# EAGLE board logicanalyzer_rev1 (EAGLE 4.16), part 1 of 2
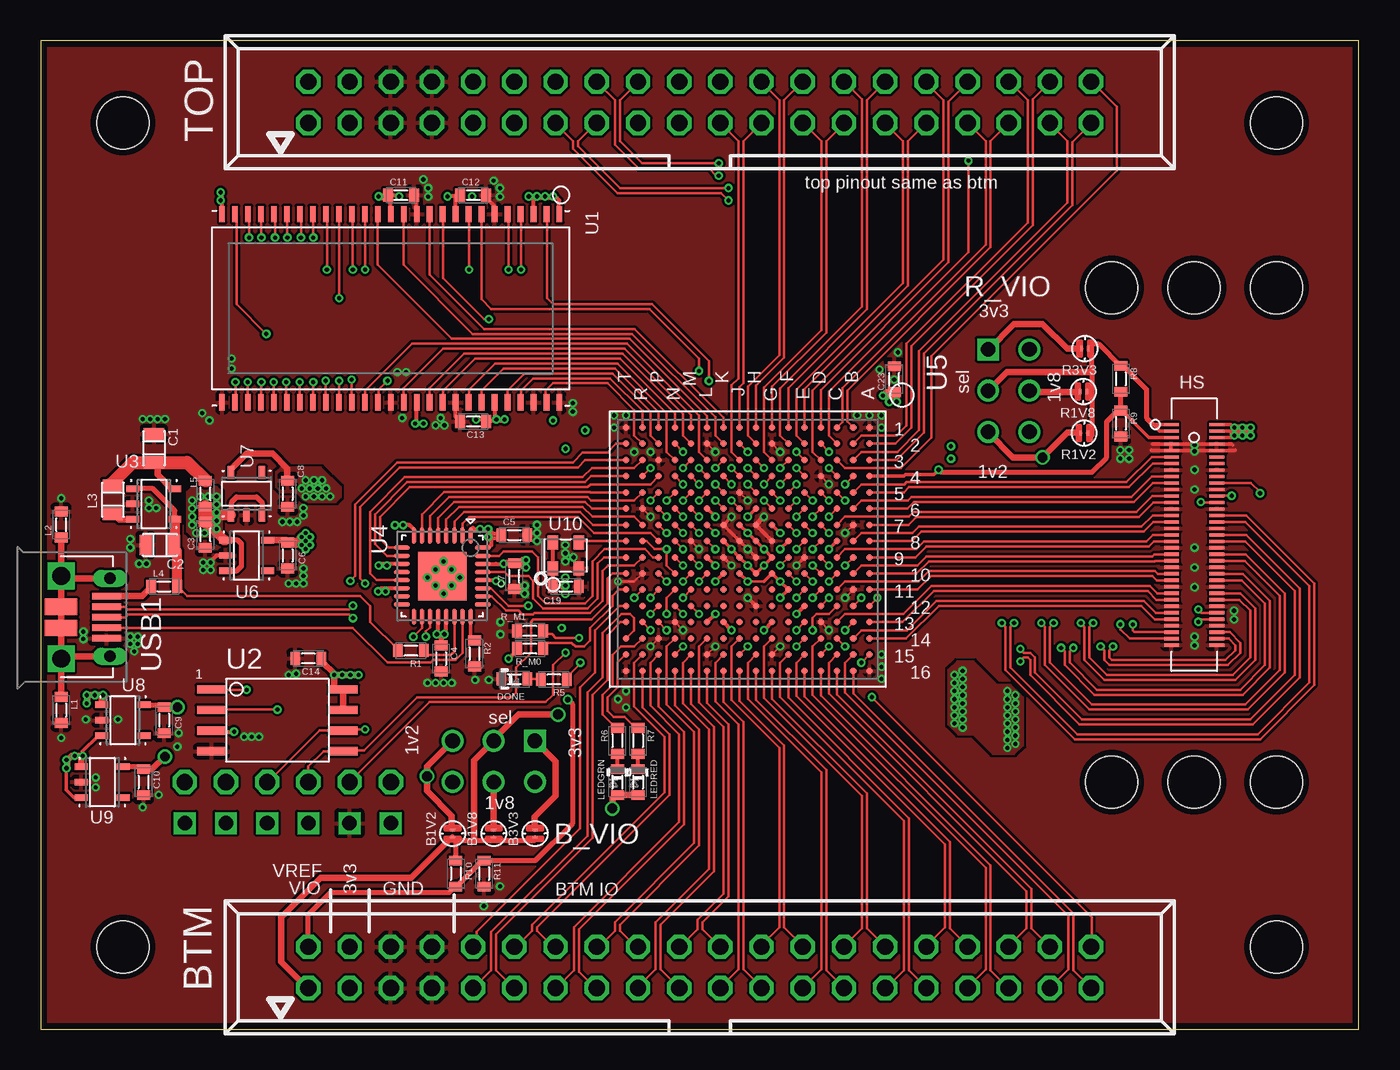
[diagram p4: board, top side]
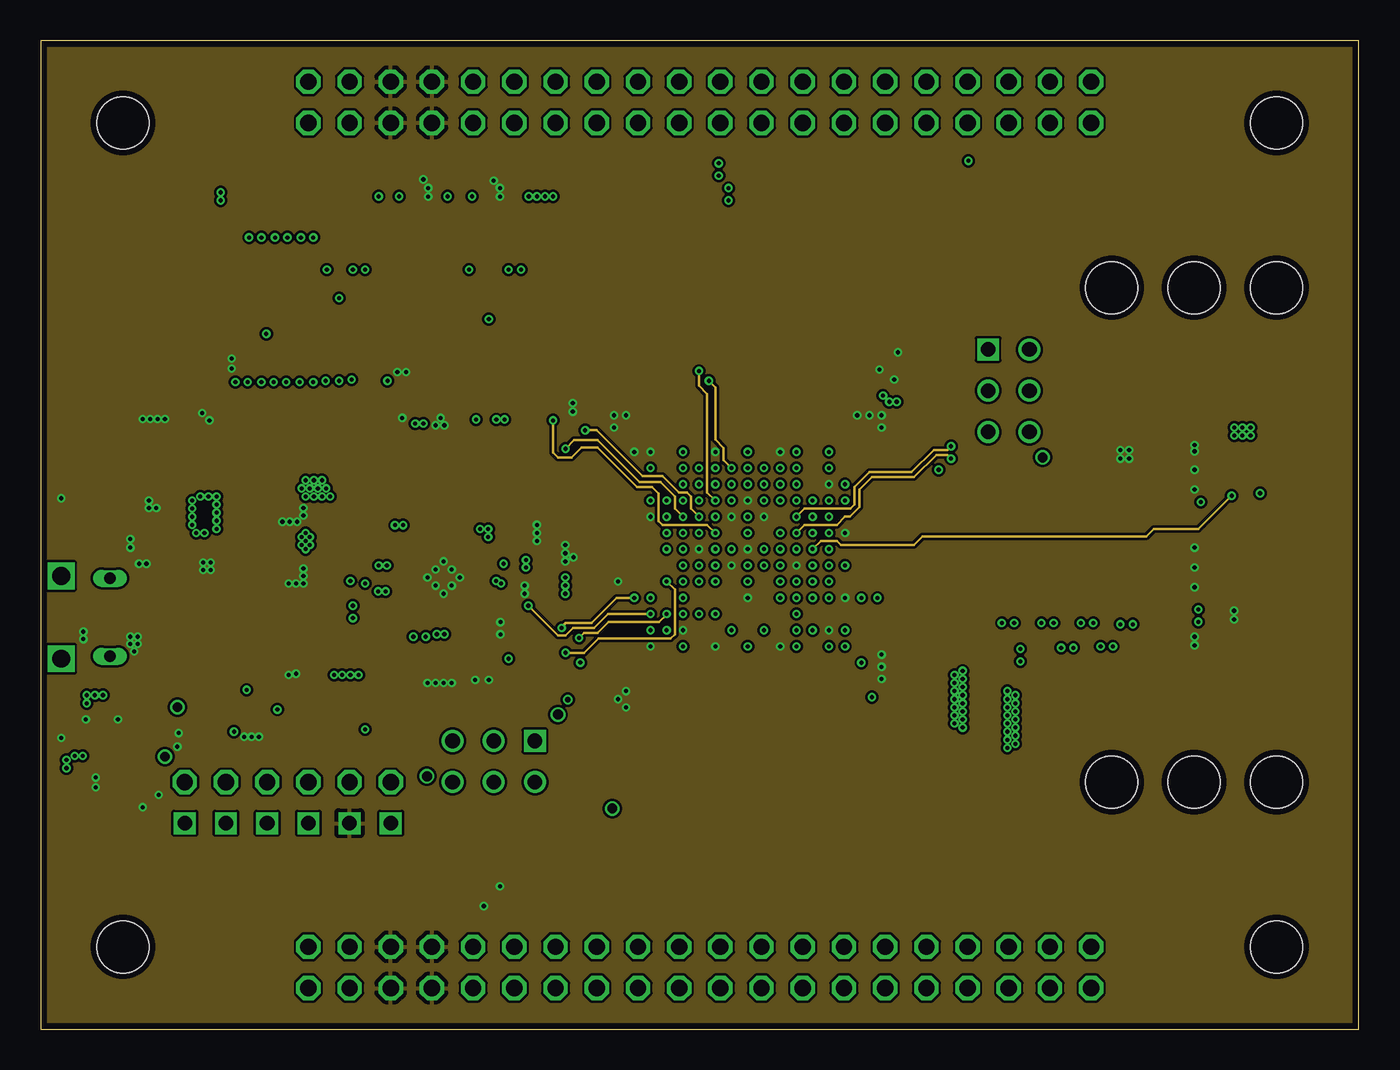
[diagram p5: board, inner layer Route2]
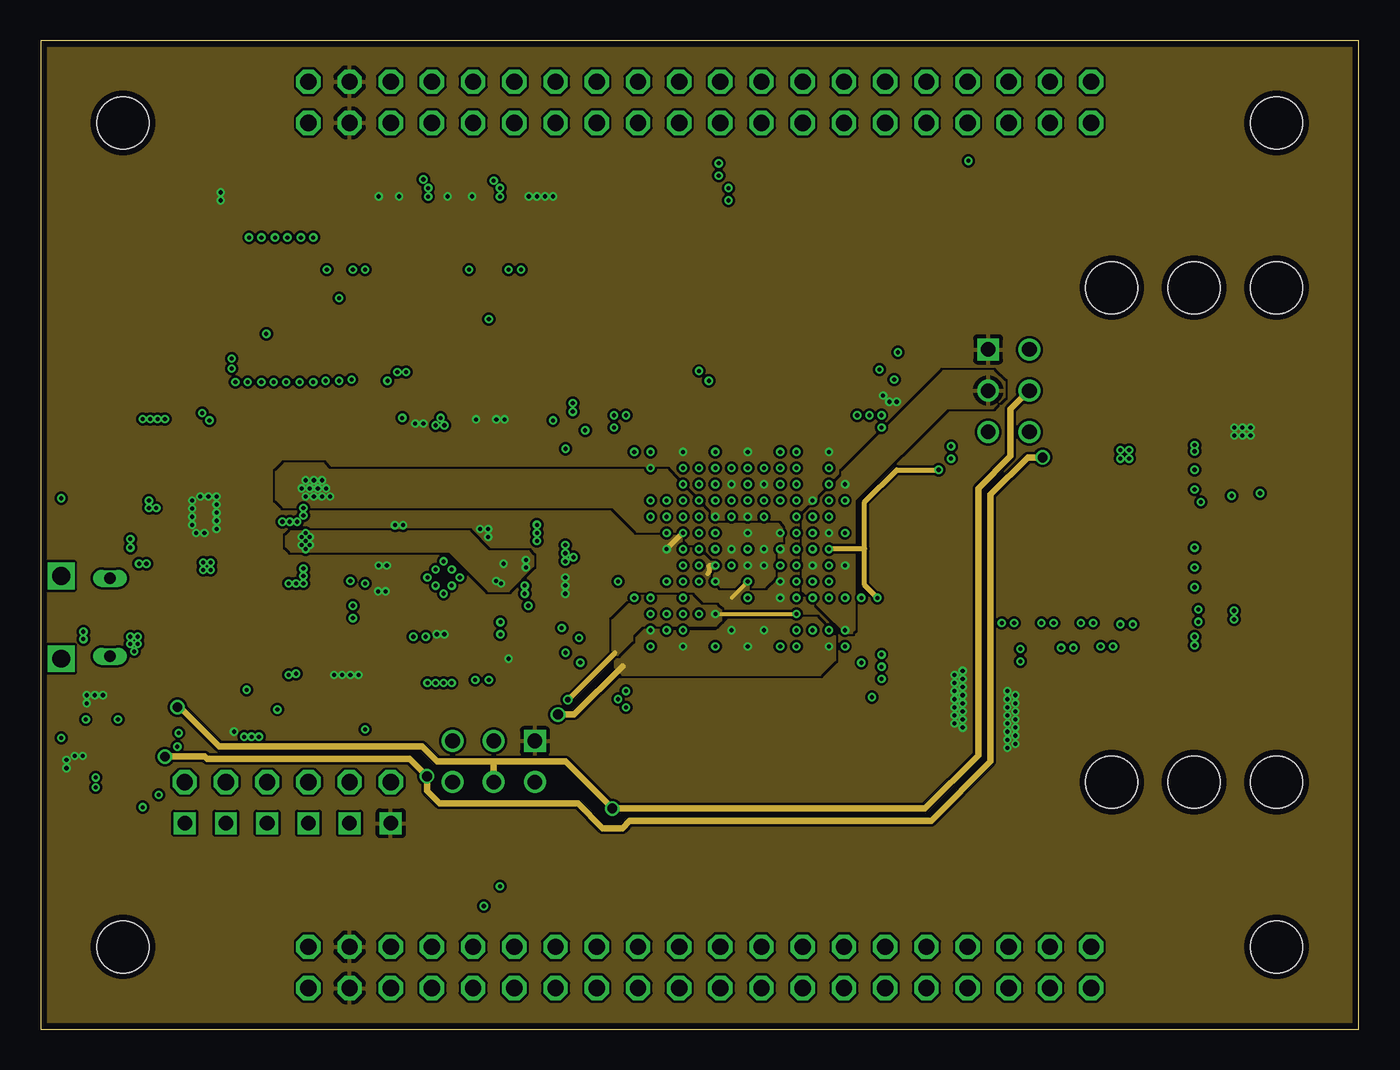
[diagram p6: board, inner layer Route15]
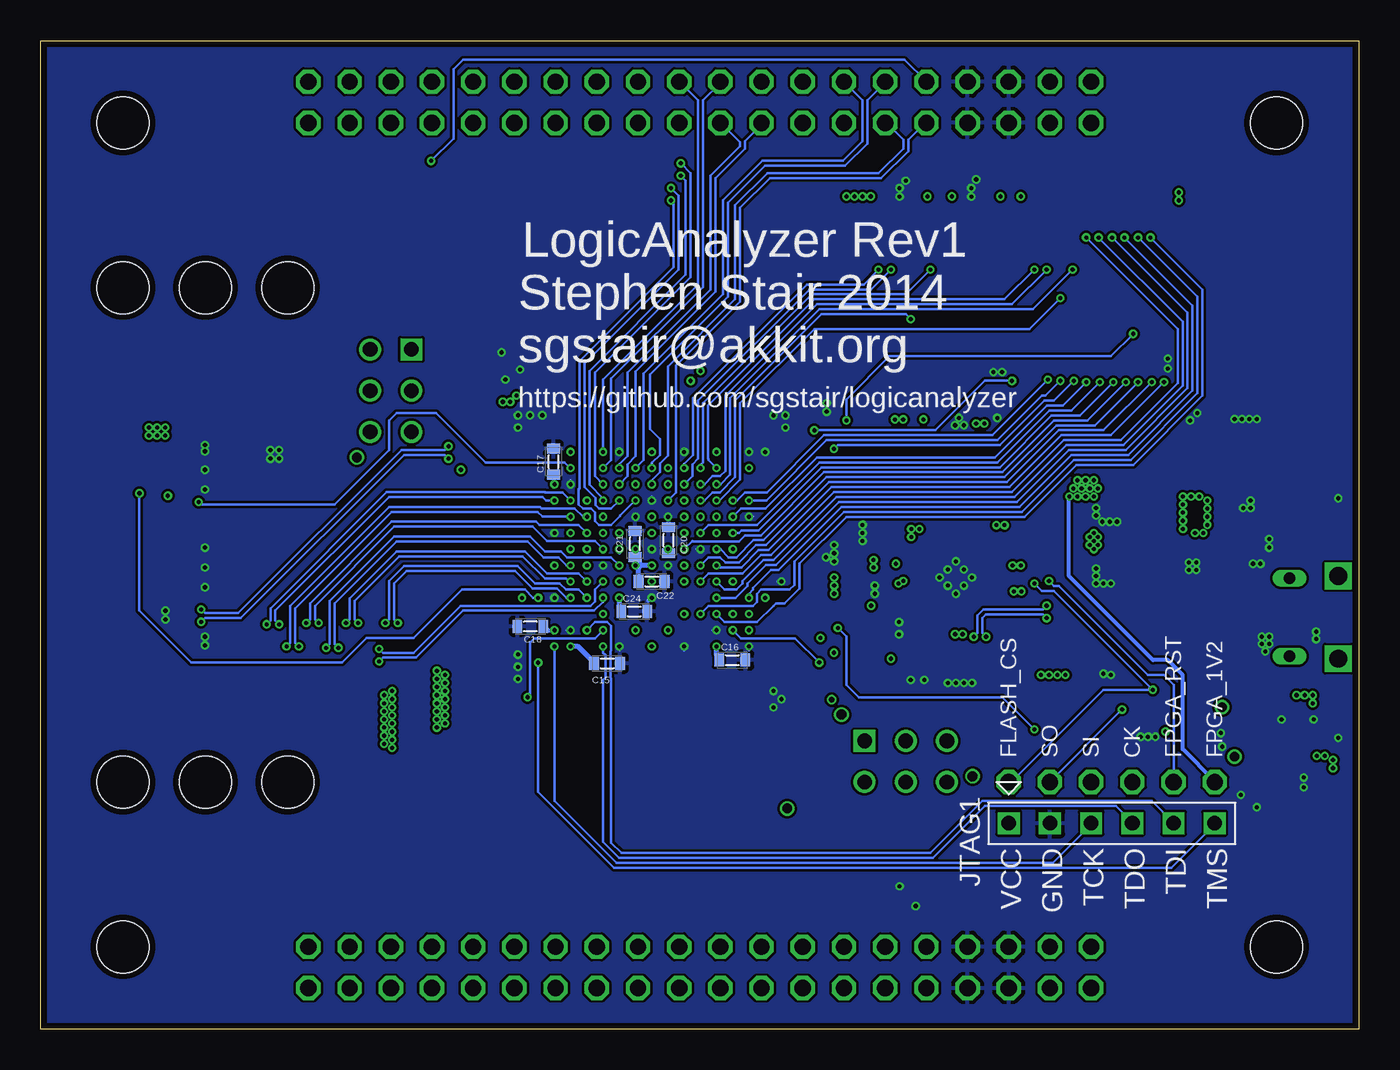
[diagram p7: board, bottom side, seen from below]

Size 81.28 x 60.96 mm. Coordinates in mm from the lower left corner, seen from the top.
Outline: 0,0 81.28,0 81.28,60.96 0,60.96 0,0
Copper layers (1+2*15+16): Top 0.0356mm / dielectric 0.2mm / Route2 0.0181mm / dielectric 1.5mm / Route15 0.0181mm / dielectric 0.2007mm / Bottom 0.0356mm
Design rules "LaenPCBOrder": minimum track width 6mil, minimum drill 10mil, track to track 5mil, track to pad 5mil, pad to pad 5mil, via to via 5mil, smd to smd 5mil, copper to edge 15mil, drill to drill 2mil, minimum pad ring 5mil, minimum via ring 5mil, stop-mask expansion 4mil, vias tented up to drill 25mil, thermal gap 10mil
Holes 3.2 mm at 5.08,5.08 5.08,55.88 76.2,55.88 76.2,5.08 66.04,45.72 71.12,15.24 71.12,45.72 76.2,45.72 66.04,15.24 76.2,15.24
tRestrict: area 23,27.7 to 23.2,28.2; area 24.4,29.5 to 25,29.6; area 26.3,27.6 to 26.4,28.2; area 24.4,26.2 to 25.1,26.3

## Footprints (pad centres in the part's own frame; a part is rotated, then mirrored left to right if it is on the bottom)
JUMPERPAD2 = smd 0.152 x 0.305: P$1 -0.203,0; P$2 0.203,0
HEADER_3X2 = drill 0.9 square: P$1 -1.27,2.54 | drill 0.9 round: P$2 1.27,2.54; P$3 -1.27,0; P$4 1.27,0; P$5 -1.27,-2.54; P$6 1.27,-2.54
057-040-1 = drill 1 octagon: 1 -24.13,-1.27; 2 -24.13,1.27; 3 -21.59,-1.27; 4 -21.59,1.27; 5 -19.05,-1.27; 6 -19.05,1.27; 7 -16.51,-1.27; 8 -16.51,1.27; 9 -13.97,-1.27; 10 -13.97,1.27; 11 -11.43,-1.27; 12 -11.43,1.27; 13 -8.89,-1.27; 14 -8.89,1.27; 15 -6.35,-1.27; 16 -6.35,1.27; 17 -3.81,-1.27; 18 -3.81,1.27; 19 -1.27,-1.27; 20 -1.27,1.27; 21 1.27,-1.27; 22 1.27,1.27; 23 3.81,-1.27; 24 3.81,1.27; 25 6.35,-1.27; 26 6.35,1.27; 27 8.89,-1.27; 28 8.89,1.27; 29 11.43,-1.27; 30 11.43,1.27; 31 13.97,-1.27; 32 13.97,1.27; 33 16.51,-1.27; 34 16.51,1.27; 35 19.05,-1.27; 36 19.05,1.27; 37 21.59,-1.27; 38 21.59,1.27; 39 24.13,-1.27; 40 24.13,1.27
SMD0805 = smd 0.75 x 1.25: P$1 0.125,-0.625; P$2 1.875,-0.625
0603 = smd 0.6 x 0.8: 1 -0.8,0; 2 0.8,0
PIN_1.0MM = drill 1 octagon: P$1 0,0
0603_DIODE = smd 0.6 x 0.8: + 0.8,0; - -0.8,0
DF40_70_BTM = smd 0.2 x 0.9: P$1 -6.8,-1.4; P$2 -6.8,1.4; P$3 -6.4,-1.4; P$4 -6.4,1.4; P$5 -6,-1.4; P$6 -6,1.4; P$7 -5.6,-1.4; P$8 -5.6,1.4; P$9 -5.2,-1.4; P$10 -5.2,1.4; P$11 -4.8,-1.4; P$12 -4.8,1.4; P$13 -4.4,-1.4; P$14 -4.4,1.4; P$15 -4,-1.4; P$16 -4,1.4; P$17 -3.6,-1.4; P$18 -3.6,1.4; P$19 -3.2,-1.4; P$20 -3.2,1.4; P$21 -2.8,-1.4; P$22 -2.8,1.4; P$23 -2.4,-1.4; P$24 -2.4,1.4; P$25 -2,-1.4; P$26 -2,1.4; P$27 -1.6,-1.4; P$28 -1.6,1.4; P$29 -1.2,-1.4; P$30 -1.2,1.4; P$31 -0.8,-1.4; P$32 -0.8,1.4; P$33 -0.4,-1.4; P$34 -0.4,1.4; P$35 0,-1.4; P$36 0,1.4; P$37 0.4,-1.4; P$38 0.4,1.4; P$39 0.8,-1.4; P$40 0.8,1.4; P$41 1.2,-1.4; P$42 1.2,1.4; P$43 1.6,-1.4; P$44 1.6,1.4; P$45 2,-1.4; P$46 2,1.4; P$47 2.4,-1.4; P$48 2.4,1.4; P$49 2.8,-1.4; P$50 2.8,1.4; P$51 3.2,-1.4; P$52 3.2,1.4; P$53 3.6,-1.4; P$54 3.6,1.4; P$55 4,-1.4; P$56 4,1.4; P$57 4.4,-1.4; P$58 4.4,1.4; P$59 4.8,-1.4; P$60 4.8,1.4; P$61 5.2,-1.4; P$62 5.2,1.4; P$63 5.6,-1.4; P$64 5.6,1.4; P$65 6,-1.4; P$66 6,1.4; P$67 6.4,-1.4; P$68 6.4,1.4; P$69 6.8,-1.4; P$70 6.8,1.4
JTAGHEADER6X1 = drill 0.9 square: P$1 0,0; P$2 2.54,0; P$3 5.08,0; P$4 7.62,0; P$5 10.16,0; P$6 12.7,0
TSOP54_0.8MM_12X22 = smd 1 x 0.35: P$1 -5.8,10.4; P$2 -5.8,9.6; P$3 -5.8,8.8; P$4 -5.8,8; P$5 -5.8,7.2; P$6 -5.8,6.4; P$7 -5.8,5.6; P$8 -5.8,4.8; P$9 -5.8,4; P$10 -5.8,3.2; P$11 -5.8,2.4; P$12 -5.8,1.6; P$13 -5.8,0.8; P$14 -5.8,0; P$15 -5.8,-0.8; P$16 -5.8,-1.6; P$17 -5.8,-2.4; P$18 -5.8,-3.2; P$19 -5.8,-4; P$20 -5.8,-4.8; P$21 -5.8,-5.6; P$22 -5.8,-6.4; P$23 -5.8,-7.2; P$24 -5.8,-8; P$25 -5.8,-8.8; P$26 -5.8,-9.6; P$27 -5.8,-10.4; P$28 5.8,-10.4; P$29 5.8,-9.6; P$30 5.8,-8.8; P$31 5.8,-8; P$32 5.8,-7.2; P$33 5.8,-6.4; P$34 5.8,-5.6; P$35 5.8,-4.8; P$36 5.8,-4; P$37 5.8,-3.2; P$38 5.8,-2.4; P$39 5.8,-1.6; P$40 5.8,-0.8; P$41 5.8,0; P$42 5.8,0.8; P$43 5.8,1.6; P$44 5.8,2.4; P$45 5.8,3.2; P$46 5.8,4; P$47 5.8,4.8; P$48 5.8,5.6; P$49 5.8,6.4; P$50 5.8,7.2; P$51 5.8,8; P$52 5.8,8.8; P$53 5.8,9.6; P$54 5.8,10.4
SOIC-8-5.3MM = smd 1.778 x 0.508: P$1 -0.889,-0.635; P$2 -0.889,-1.905; P$3 -0.889,-3.175; P$4 -0.889,-4.445; P$5 7.239,-4.445; P$6 7.239,-3.175; P$7 7.239,-1.905; P$8 7.239,-0.635
SOT-23-5 = smd 0.8 x 0.4: 1 -1.3,0.95; 2 -1.3,0; 3 -1.3,-0.95; 4 1.3,-0.95; 5 1.3,0.95
QFG32PAD_.5MM_5X5 = smd 1 x 0.25: 1 -2.5,1.75; 2 -2.5,1.25; 3 -2.5,0.75; 4 -2.5,0.25; 5 -2.5,-0.25; 6 -2.5,-0.75; 7 -2.5,-1.25; 8 -2.5,-1.75; 17 2.5,-1.75; 18 2.5,-1.25; 19 2.5,-0.75; 20 2.5,-0.25; 21 2.5,0.25; 22 2.5,0.75; 23 2.5,1.25; 24 2.5,1.75 | smd 0.25 x 1: 9 -1.75,-2.5; 10 -1.25,-2.5; 11 -0.75,-2.5; 12 -0.25,-2.5; 13 0.25,-2.5; 14 0.75,-2.5; 15 1.25,-2.5; 16 1.75,-2.5; 25 1.75,2.5; 26 1.25,2.5; 27 0.75,2.5; 28 0.25,2.5; 29 -0.25,2.5; 30 -0.75,2.5; 31 -1.25,2.5; 32 -1.75,2.5 | smd 3 x 3: PAD 0,0
FG256_1MM_17X17 = smd 0.4 x 0.4: A1 -7.5,7.5; A2 -6.5,7.5; A3 -5.5,7.5; A4 -4.5,7.5; A5 -3.5,7.5; A6 -2.5,7.5; A7 -1.5,7.5; A8 -0.5,7.5; A9 0.5,7.5; A10 1.5,7.5; A11 2.5,7.5; A12 3.5,7.5; A13 4.5,7.5; A14 5.5,7.5; A15 6.5,7.5; A16 7.5,7.5; B1 -7.5,6.5; B2 -6.5,6.5; B3 -5.5,6.5; B4 -4.5,6.5; B5 -3.5,6.5; B6 -2.5,6.5; B7 -1.5,6.5; B8 -0.5,6.5; B9 0.5,6.5; B10 1.5,6.5; B11 2.5,6.5; B12 3.5,6.5; B13 4.5,6.5; B14 5.5,6.5; B15 6.5,6.5; B16 7.5,6.5; C1 -7.5,5.5; C2 -6.5,5.5; C3 -5.5,5.5; C4 -4.5,5.5; C5 -3.5,5.5; C6 -2.5,5.5; C7 -1.5,5.5; C8 -0.5,5.5; C9 0.5,5.5; C10 1.5,5.5; C11 2.5,5.5; C12 3.5,5.5; C13 4.5,5.5; C14 5.5,5.5; C15 6.5,5.5; C16 7.5,5.5; D1 -7.5,4.5; D2 -6.5,4.5; D3 -5.5,4.5; D4 -4.5,4.5; D5 -3.5,4.5; D6 -2.5,4.5; D7 -1.5,4.5; D8 -0.5,4.5; D9 0.5,4.5; D10 1.5,4.5; D11 2.5,4.5; D12 3.5,4.5; D13 4.5,4.5; D14 5.5,4.5; D15 6.5,4.5; D16 7.5,4.5; E1 -7.5,3.5; E2 -6.5,3.5; E3 -5.5,3.5; E4 -4.5,3.5; E5 -3.5,3.5; E6 -2.5,3.5; E7 -1.5,3.5; E8 -0.5,3.5; E9 0.5,3.5; E10 1.5,3.5; E11 2.5,3.5; E12 3.5,3.5; E13 4.5,3.5; E14 5.5,3.5; E15 6.5,3.5; E16 7.5,3.5; F1 -7.5,2.5; F2 -6.5,2.5; F3 -5.5,2.5; F4 -4.5,2.5; F5 -3.5,2.5; F6 -2.5,2.5; F7 -1.5,2.5; F8 -0.5,2.5; F9 0.5,2.5; F10 1.5,2.5; F11 2.5,2.5; F12 3.5,2.5; F13 4.5,2.5; F14 5.5,2.5; F15 6.5,2.5; F16 7.5,2.5; G1 -7.5,1.5; G2 -6.5,1.5; G3 -5.5,1.5; G4 -4.5,1.5; G5 -3.5,1.5; G6 -2.5,1.5; G7 -1.5,1.5; G8 -0.5,1.5; G9 0.5,1.5; G10 1.5,1.5; G11 2.5,1.5; G12 3.5,1.5; G13 4.5,1.5; G14 5.5,1.5; G15 6.5,1.5; G16 7.5,1.5; H1 -7.5,0.5; H2 -6.5,0.5; H3 -5.5,0.5; H4 -4.5,0.5; H5 -3.5,0.5; H6 -2.5,0.5; H7 -1.5,0.5; H8 -0.5,0.5; H9 0.5,0.5; H10 1.5,0.5; H11 2.5,0.5; H12 3.5,0.5; H13 4.5,0.5; H14 5.5,0.5; H15 6.5,0.5; H16 7.5,0.5; J1 -7.5,-0.5; J2 -6.5,-0.5; J3 -5.5,-0.5; J4 -4.5,-0.5; J5 -3.5,-0.5; J6 -2.5,-0.5; J7 -1.5,-0.5; J8 -0.5,-0.5; J9 0.5,-0.5; J10 1.5,-0.5; J11 2.5,-0.5; J12 3.5,-0.5; J13 4.5,-0.5; J14 5.5,-0.5; J15 6.5,-0.5; J16 7.5,-0.5; K1 -7.5,-1.5; K2 -6.5,-1.5; K3 -5.5,-1.5; K4 -4.5,-1.5; K5 -3.5,-1.5; K6 -2.5,-1.5; K7 -1.5,-1.5; K8 -0.5,-1.5; K9 0.5,-1.5; K10 1.5,-1.5; K11 2.5,-1.5; K12 3.5,-1.5; K13 4.5,-1.5; K14 5.5,-1.5; K15 6.5,-1.5; K16 7.5,-1.5; L1 -7.5,-2.5; L2 -6.5,-2.5; L3 -5.5,-2.5; L4 -4.5,-2.5; L5 -3.5,-2.5; L6 -2.5,-2.5; L7 -1.5,-2.5; L8 -0.5,-2.5; L9 0.5,-2.5; L10 1.5,-2.5; L11 2.5,-2.5; L12 3.5,-2.5; L13 4.5,-2.5; L14 5.5,-2.5; L15 6.5,-2.5; L16 7.5,-2.5; M1 -7.5,-3.5; M2 -6.5,-3.5; M3 -5.5,-3.5; M4 -4.5,-3.5; M5 -3.5,-3.5; M6 -2.5,-3.5; M7 -1.5,-3.5; M8 -0.5,-3.5; M9 0.5,-3.5; M10 1.5,-3.5; M11 2.5,-3.5; M12 3.5,-3.5; M13 4.5,-3.5; M14 5.5,-3.5; M15 6.5,-3.5; M16 7.5,-3.5; N1 -7.5,-4.5; N2 -6.5,-4.5; N3 -5.5,-4.5; N4 -4.5,-4.5; N5 -3.5,-4.5; N6 -2.5,-4.5; N7 -1.5,-4.5; N8 -0.5,-4.5; N9 0.5,-4.5; N10 1.5,-4.5; N11 2.5,-4.5; N12 3.5,-4.5; N13 4.5,-4.5; N14 5.5,-4.5; N15 6.5,-4.5; N16 7.5,-4.5; P1 -7.5,-5.5; P2 -6.5,-5.5; P3 -5.5,-5.5; P4 -4.5,-5.5; P5 -3.5,-5.5; P6 -2.5,-5.5; P7 -1.5,-5.5; P8 -0.5,-5.5; P9 0.5,-5.5; P10 1.5,-5.5; P11 2.5,-5.5; P12 3.5,-5.5; P13 4.5,-5.5; P14 5.5,-5.5; P15 6.5,-5.5; P16 7.5,-5.5; R1 -7.5,-6.5; R2 -6.5,-6.5; R3 -5.5,-6.5; R4 -4.5,-6.5; R5 -3.5,-6.5; R6 -2.5,-6.5; R7 -1.5,-6.5; R8 -0.5,-6.5; R9 0.5,-6.5; R10 1.5,-6.5; R11 2.5,-6.5; R12 3.5,-6.5; R13 4.5,-6.5; R14 5.5,-6.5; R15 6.5,-6.5; R16 7.5,-6.5; T1 -7.5,-7.5; T2 -6.5,-7.5; T3 -5.5,-7.5; T4 -4.5,-7.5; T5 -3.5,-7.5; T6 -2.5,-7.5; T7 -1.5,-7.5; T8 -0.5,-7.5; T9 0.5,-7.5; T10 1.5,-7.5; T11 2.5,-7.5; T12 3.5,-7.5; T13 4.5,-7.5; T14 5.5,-7.5; T15 6.5,-7.5; T16 7.5,-7.5
ASDMB_2X2.5 = smd 0.65 x 0.85: 1 -0.8,-0.8; 2 0.8,-0.8; 3 0.8,0.8; 4 -0.8,0.8
USB_MICROB_FEMALE_FCI_10103594 = smd 0.4 x 1.8: 1 -1.3,2.8; 2 -0.65,2.8; 3 0,2.8; 4 0.65,2.8; 5 1.3,2.8 | drill 0.7 long: G1 -2.4,3; G2 2.4,3 | smd 1 x 2: G3 -0.65,0; G4 0.65,0 | drill 1.1 square: G5 -2.55,0; G6 2.55,0

## Placement (x,y rotation side)
B1V2  JUMPER2  [JUMPERPAD2]  25.4,12.07 90 top
B1V8  JUMPER2  [JUMPERPAD2]  27.94,12.07 90 top
B3V3  JUMPER2  [JUMPERPAD2]  30.48,12.07 90 top
B_VIO  HEADER_3X2  [HEADER_3X2]  27.94,16.51 270 top
BTM  057-040-1  [057-040-1]  40.64,3.81 0 top
C1  10uF  [SMD0805]  7.62,36.83 270 top
C2  4.7uF, 10V  [SMD0805]  6.35,30.48 0 top
C3  4.7uF  [0603]  10.16,30.48 90 top
C4  1uF  [0603]  24.69,22.86 270 top
C5  0.1uF  [0603]  29.21,30.48 0 top
C6  1uF  [0603]  15.24,29.21 270 top
C7  0.1uF  [0603]  29.21,27.94 90 top
C8  1uF  [0603]  15.24,33.02 270 top
C9  1uF  [0603]  7.62,19.05 270 top
C10  1uF  [0603]  6.35,15.24 270 top
C11  1uF  [0603]  22.23,51.43 0 top
C12  .1uF  [0603]  26.67,51.43 0 top
C13  .1uF  [0603]  26.67,37.47 180 top
C14  .1uF  [0603]  16.51,22.86 180 top
C15  0.1uF  [0603]  46.35,22.56 0 bottom
C16  0.1uF  [0603]  38.63,22.76 0 bottom
C17  0.1uF  [0603]  49.66,35 90 bottom
C18  0.1uF  [0603]  51.08,24.84 180 bottom
C19  0.1uF  [0603]  32.38,27.3 0 top
C20  0.1uF  [0603]  42.57,30.15 90 bottom
C21  0.1uF  [0603]  44.63,29.92 90 bottom
C22  1uF  [0603]  43.61,27.61 0 bottom
C23  0.1uF  [0603]  52.63,40.08 90 top
C24  0.1uF  [0603]  44.68,25.76 0 bottom
CK  PIN1.0MM  [PIN_1.0MM]  13.97,15.24 90 bottom
DONE  LED0603  [0603_DIODE]  29.21,21.59 0 top
FLASH_CS  PIN1.0MM  [PIN_1.0MM]  21.59,15.24 90 bottom
FPGA_1V2  PIN1.0MM  [PIN_1.0MM]  8.89,15.24 90 bottom
FPGA_RST  PIN1.0MM  [PIN_1.0MM]  11.43,15.24 90 bottom
HS  DF40_70BTM  [DF40_70_BTM]  71.12,30.48 270 top
JTAG1  JTAG-HEADER  [JTAGHEADER6X1]  21.59,12.7 0 bottom
L1  possible ferrite  [0603]  1.27,19.69 270 top
L2  possible ferrite  [0603]  1.27,31.12 90 top
L3  1uH  [SMD0805]  5.08,33.66 270 top
L4  220ohm ferrite  [0603]  7.62,27.3 0 top
L5  220ohm ferrite  [0603]  10.16,33.02 90 top
LEDGRN  LED0603  [0603_DIODE]  35.56,15.24 270 top
LEDRED  LED0603  [0603_DIODE]  36.83,15.24 270 top
R1  10k  [0603]  22.83,23.34 180 top
R1V2  JUMPER2  [JUMPERPAD2]  64.34,36.75 180 top
R1V8  JUMPER2  [JUMPERPAD2]  64.29,39.32 180 top
R2  8.06k 1%  [0603]  26.75,23.16 270 top
R3V3  JUMPER2  [JUMPERPAD2]  64.39,41.96 180 top
R5  1.5k  [0603]  31.65,21.56 180 top
R6  1.5k  [0603]  35.56,17.78 270 top
R7  1.5k  [0603]  36.83,17.78 270 top
R8  10k  [0603]  66.6,40.1 270 top
R9  10k  [0603]  66.6,37.35 270 top
R10  10k  [0603]  25.6,9.6 270 top
R11  10k  [0603]  27.35,9.6 270 top
R_M0  0 ohm  [0603]  30.18,23.47 180 top
R_M1  0 ohm  [0603]  30.18,24.56 180 top
R_VIO  HEADER_3X2  [HEADER_3X2]  59.69,39.37 0 top
SI  PIN1.0MM  [PIN_1.0MM]  16.51,15.24 90 bottom
SO  PIN1.0MM  [PIN_1.0MM]  19.05,15.24 90 bottom
TOP  057-040-1  [057-040-1]  40.64,57.15 0 top
U1  SDRAM_256MBIT_TSOP54  [TSOP54_0.8MM_12X22]  21.59,44.45 270 top
U2  M25P32_SERIALFLASH  [SOIC-8-5.3MM]  11.43,21.59 0 top
U3  VREG_SW_FT440  [SOT-23-5]  6.98,32.38 0 top
U4  USB3320  [QFG32PAD_.5MM_5X5]  24.77,27.94 270 top
U5  SPARTAN6-FT256  [FG256_1MM_17X17]  43.6,29.6 270 top
U6  1.8V  [SOT-23-5]  12.7,29.21 0 top
U7  1.2V  [SOT-23-5]  12.7,33.02 90 top
U8  1.8V  [SOT-23-5]  5.08,19.05 0 top
U9  1.2V  [SOT-23-5]  3.81,15.24 0 top
U10  60MHz  [ASDMB_2X2.5]  32.38,29.21 0 top
USB1  USB_MICROB  [USB_MICROB_FEMALE_FCI_10103594]  1.27,25.4 270 top